# Altium schematic sheet lv_io_harness.SchDoc
size A4; Organization: Badgerloop; Address1: 133 Engineering Research; Address2: Building; Address3: Madison, WI 53715
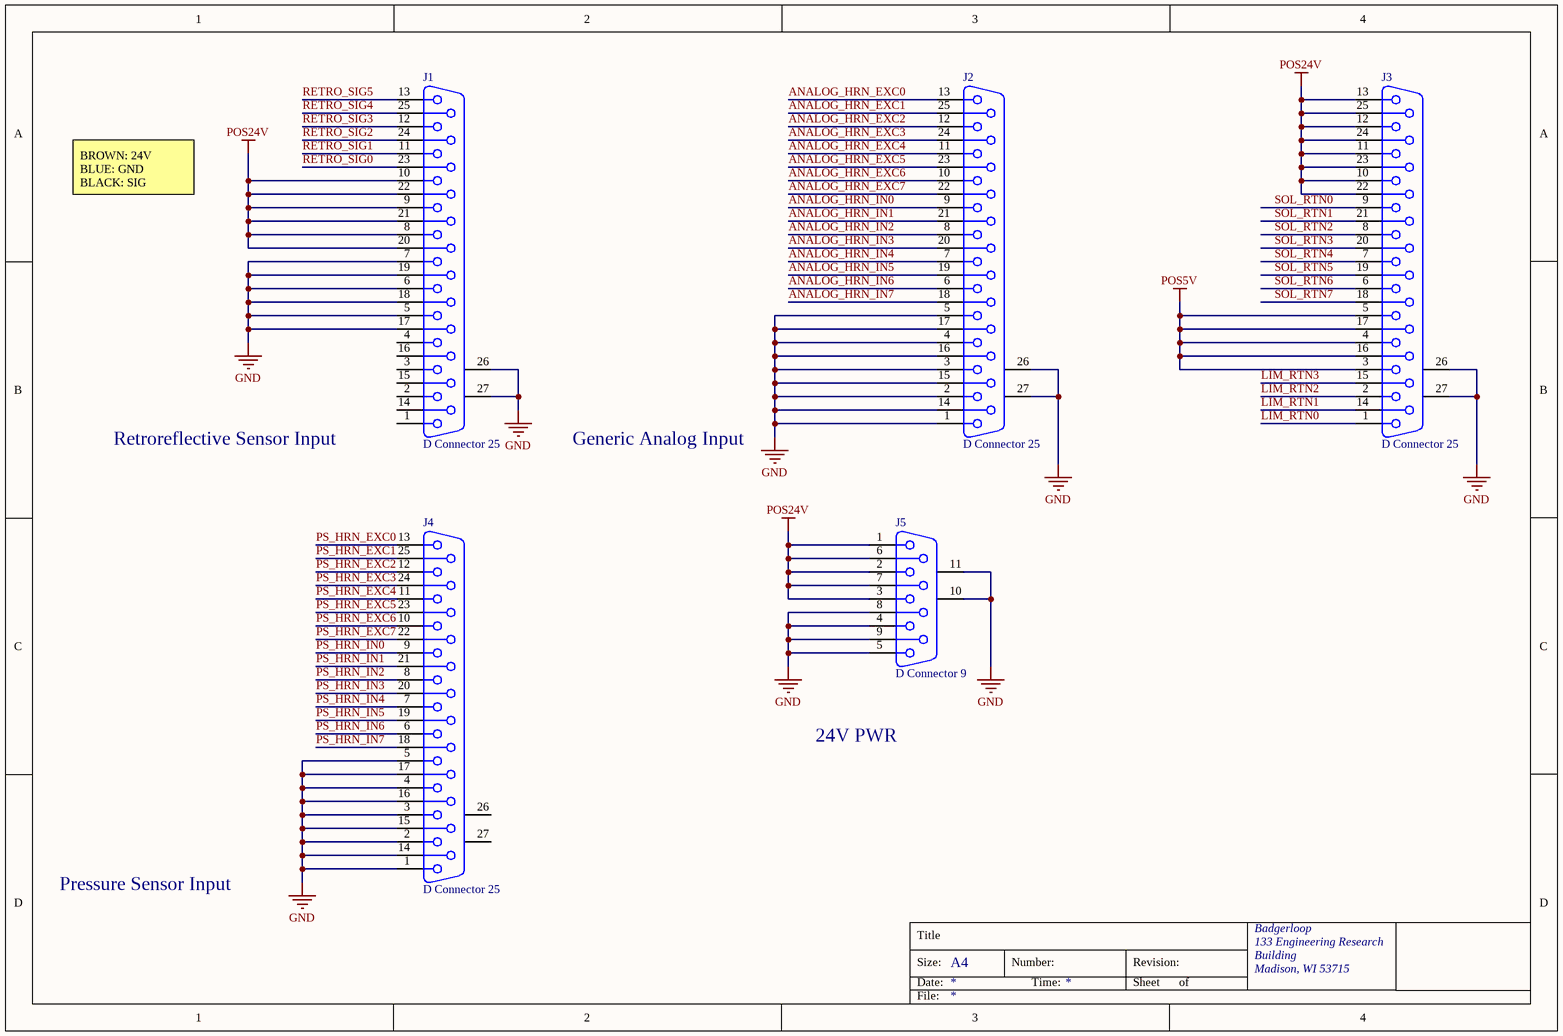
[diagram p0: lv_io_harness.SchDoc]

## Parts
J1  D Connector 25  [DSUB1.385-2H25A]
J2  D Connector 25  [DSUB1.385-2H25A]
J3  D Connector 25  [DSUB1.385-2H25A]
J4  D Connector 25  [DSUB1.385-2H25A]
J5  D Connector 9  [DSUB1.385-2H9]

## Nets
GND: J1.5 J1.6 J1.7 J1.17 J1.18 J1.19 J1.26(MH1) J1.27(MH2) J2.1 J2.2 J2.3 J2.4 J2.5 J2.14 J2.15 J2.16 J2.17 J2.26(MH1) J2.27(MH2) J3.26(MH1) J3.27(MH2) J4.1 J4.2 J4.3 J4.4 J4.5 J4.14 J4.15 J4.16 J4.17 J5.4 J5.5 J5.8 J5.9 J5.10(MH1) J5.11(MH2)
POS5V: J3.3 J3.4 J3.5 J3.16 J3.17
POS24V: J1.8 J1.9 J1.10 J1.20 J1.21 J1.22 J3.10 J3.11 J3.12 J3.13 J3.22 J3.23 J3.24 J3.25 J5.1 J5.2 J5.3 J5.6 J5.7
ANALOG_HRN_EXC0: J2.13
ANALOG_HRN_EXC1: J2.25
ANALOG_HRN_EXC2: J2.12
ANALOG_HRN_EXC3: J2.24
ANALOG_HRN_EXC4: J2.11
ANALOG_HRN_EXC5: J2.23
ANALOG_HRN_EXC6: J2.10
ANALOG_HRN_EXC7: J2.22
ANALOG_HRN_IN0: J2.9
ANALOG_HRN_IN1: J2.21
ANALOG_HRN_IN2: J2.8
ANALOG_HRN_IN3: J2.20
ANALOG_HRN_IN4: J2.7
ANALOG_HRN_IN5: J2.19
ANALOG_HRN_IN6: J2.6
ANALOG_HRN_IN7: J2.18
LIM_RTN0: J3.1
LIM_RTN1: J3.14
LIM_RTN2: J3.2
LIM_RTN3: J3.15
PS_HRN_EXC0: J4.13
PS_HRN_EXC1: J4.25
PS_HRN_EXC2: J4.12
PS_HRN_EXC3: J4.24
PS_HRN_EXC4: J4.11
PS_HRN_EXC5: J4.23
PS_HRN_EXC6: J4.10
PS_HRN_EXC7: J4.22
PS_HRN_IN0: J4.9
PS_HRN_IN1: J4.21
PS_HRN_IN2: J4.8
PS_HRN_IN3: J4.20
PS_HRN_IN4: J4.7
PS_HRN_IN5: J4.19
PS_HRN_IN6: J4.6
PS_HRN_IN7: J4.18
RETRO_SIG0: J1.23
RETRO_SIG1: J1.11
RETRO_SIG2: J1.24
RETRO_SIG3: J1.12
RETRO_SIG4: J1.25
RETRO_SIG5: J1.13
SOL_RTN0: J3.9
SOL_RTN1: J3.21
SOL_RTN2: J3.8
SOL_RTN3: J3.20
SOL_RTN4: J3.7
SOL_RTN5: J3.19
SOL_RTN6: J3.6
SOL_RTN7: J3.18

Not connected (* = marked no-connect by the designer): J1 1 2 3 4 14 15 16; J4 26(MH1) 27(MH2)

## Notes on the sheet
- BROWN: 24V
  BLUE: GND
  BLACK: SIG
- (near J1) Retroreflective Sensor Input
- Generic Analog Input
- 24V PWR
- Pressure Sensor Input
- Title
- Size:
- Date:
- A4
- Number:
- Time:
- Revision:
- Sheet
- of
- File:

## Library data of the parts
J1-J4 = D Connector 25: Receptacle Assembly, 25 Position, Right Angle; PackageDocument: U; Positions: 25; Published: 15-Jun-2001; LatestRevisionDate: 17-Jul-2002; LatestRevisionNote: Re-released for DXP Platform.; DatasheetDocument: 19-Mar-1999; PackageReference: 787202; Publisher: Altium Limited; Orientation: Right Angle; Gender: Receptacle
J5 = D Connector 9: Receptacle Assembly, 9 Position, Right Angle; PackageDocument: O; Positions: 9; Published: 15-Jun-2001; LatestRevisionDate: 17-Jul-2002; LatestRevisionNote: Re-released for DXP Platform.; DatasheetDocument: 1-Sep-1999; PackageReference: 788750; Publisher: Altium Limited; Orientation: Right Angle; Gender: Receptacle